# EAGLE schematic PDB Protection Prototype (EAGLE 8.3.2)
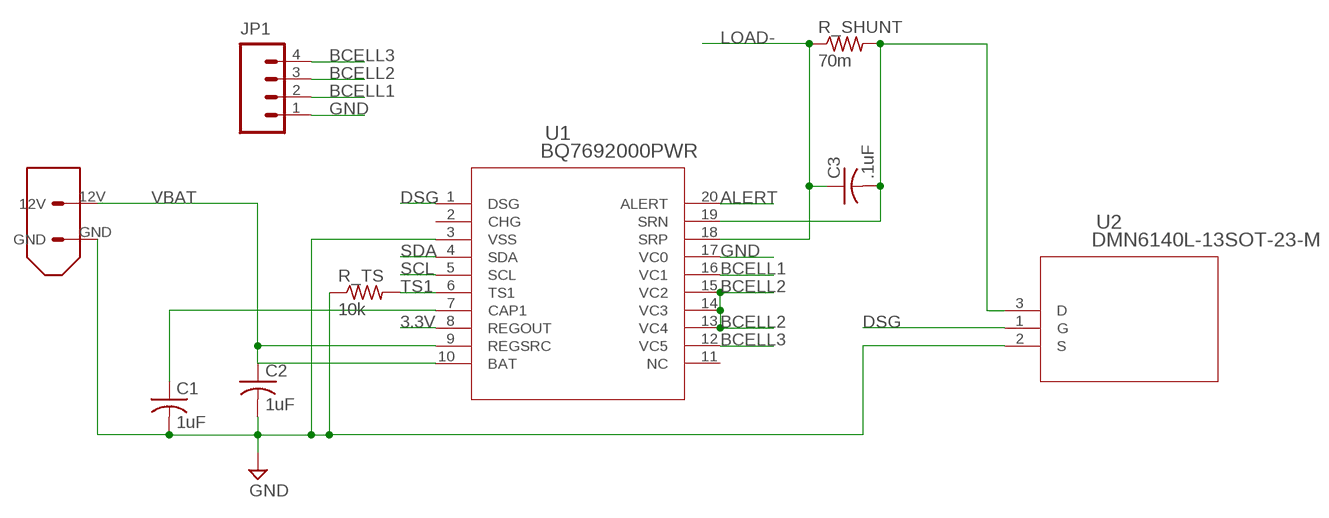
[diagram p0: schematic, sheet 1]

## Parts
C1  1uF  C-USC0402  [C0402]
C2  1uF  C-USC0402  [C0402]
C3  .1uF  C-USC0402  [C0402]
JP1  M041X04-MTA  [1X04-MTA]
R_SHUNT  70m  R-US_R2512  [R2512]
R_TS  10k  R-US_R0603  [R0603]
U1  BQ7692000PWR  [PW20]
U2  DMN6140L-13SOT-23-M  [SOT-23-M]
U$1  XT60CONNECTOR  [XT60CONNECTOR]

## Nets
3.3V: U1.8(REGOUT)
ALERT: U1.20(ALERT)
BCELL1: JP1.2 U1.16(VC1)
BCELL2: JP1.3 U1.13(VC4) U1.14(VC3) U1.15(VC2)
BCELL3: JP1.4 U1.12(VC5)
DSG: U1.1(DSG) U2.1(G)
GND: C1.2 C2.2 JP1.1 R_TS.1 U1.3(VSS) U1.17(VC0) U2.2(S) U$1.GND
LOAD-: C3.1 R_SHUNT.1 U1.18(SRP)
N$3: C3.2 R_SHUNT.2 U1.19(SRN) U2.3(D)
N$5: C1.1 U1.7(CAP1)
SCL: U1.5(SCL)
SDA: U1.4(SDA)
TS1: R_TS.2 U1.6(TS1)
VBAT: C2.1 U1.9(REGSRC) U1.10(BAT) U$1.12V
Unconnected: U1.2(CHG) U1.11(NC)

## Library data of the parts
C1 C2 = adafruit:C-US: CAPACITOR, American symbol; CAPACITANCE: 1uF; DIGIKEY_LINK: https://www.digikey.com/product-detail/en/tdk-corporation/CGB2A1X5R1E105K033BC/445-13185-1-ND/3954851; PART_NUMBER: CGB2A1X5R1E105K033BC; VOLTAGE: 25V
C3 = adafruit:C-US: CAPACITOR, American symbol; CAPACITANCE: .1uF; DIGIKEY_LINK: https://www.digikey.com/product-detail/en/samsung-electro-mechanics/CL05A104MP5NNNC/1276-1443-1-ND/3889529; PART_NUMBER: CL05A104MP5NNNC; VOLTAGE: 10V
JP1 = pie:M04: 4-pin 0.1-inch header and MTA connector; PIE-INT-REF-NUM: MTA
R_SHUNT = adafruit:R-US_: RESISTOR, American symbol; DIGIEKY_LINK: https://www.digikey.com/product-detail/en/bourns-inc/CRA2512-FZ-R070ELF/CRA2512-FZ-R070ELFTR-ND/2563873; PART_NUMBER: CRA2512-FZ-R070ELF; POWER: 3W; RESISTANCE: 70m; TOLERANCE: 1%
R_TS = adafruit:R-US_: RESISTOR, American symbol
U1 = BQ7292000PWR:BQ7692000PWR; MANUFACTURER_PART_NUMBER: BQ7692000PWR; VENDOR: Texas Instruments
U2 = DMN6140L:DMN6140L-13; DIGIKEY_LINK: https://www.digikey.com/product-detail/en/diodes-incorporated/DMN6140L-13/DMN6140L-13DICT-ND/5218250; FET_TYPE: N-Channel; ID: 1.6A; MANUFACTURER_PART_NUMBER: DMN6140L13; VDSS: 60V; VENDOR: Diodes Inc; VGS_TH: 3V
U$1 = pie:XT60CONNECTOR: 12V XT60 power connector; PARTNUMBER: PRT-10474